# Altium schematic sheet MCUPinout.SchDoc
size 393 x 279 mm; DrawnBy: Gustav Eckerbom; SheetNumber: 5; SheetTotal: 6; Project: alife7-genx320cam; Sheet Name: I/O; Sheet Size: A3; Project Revision: Rev1
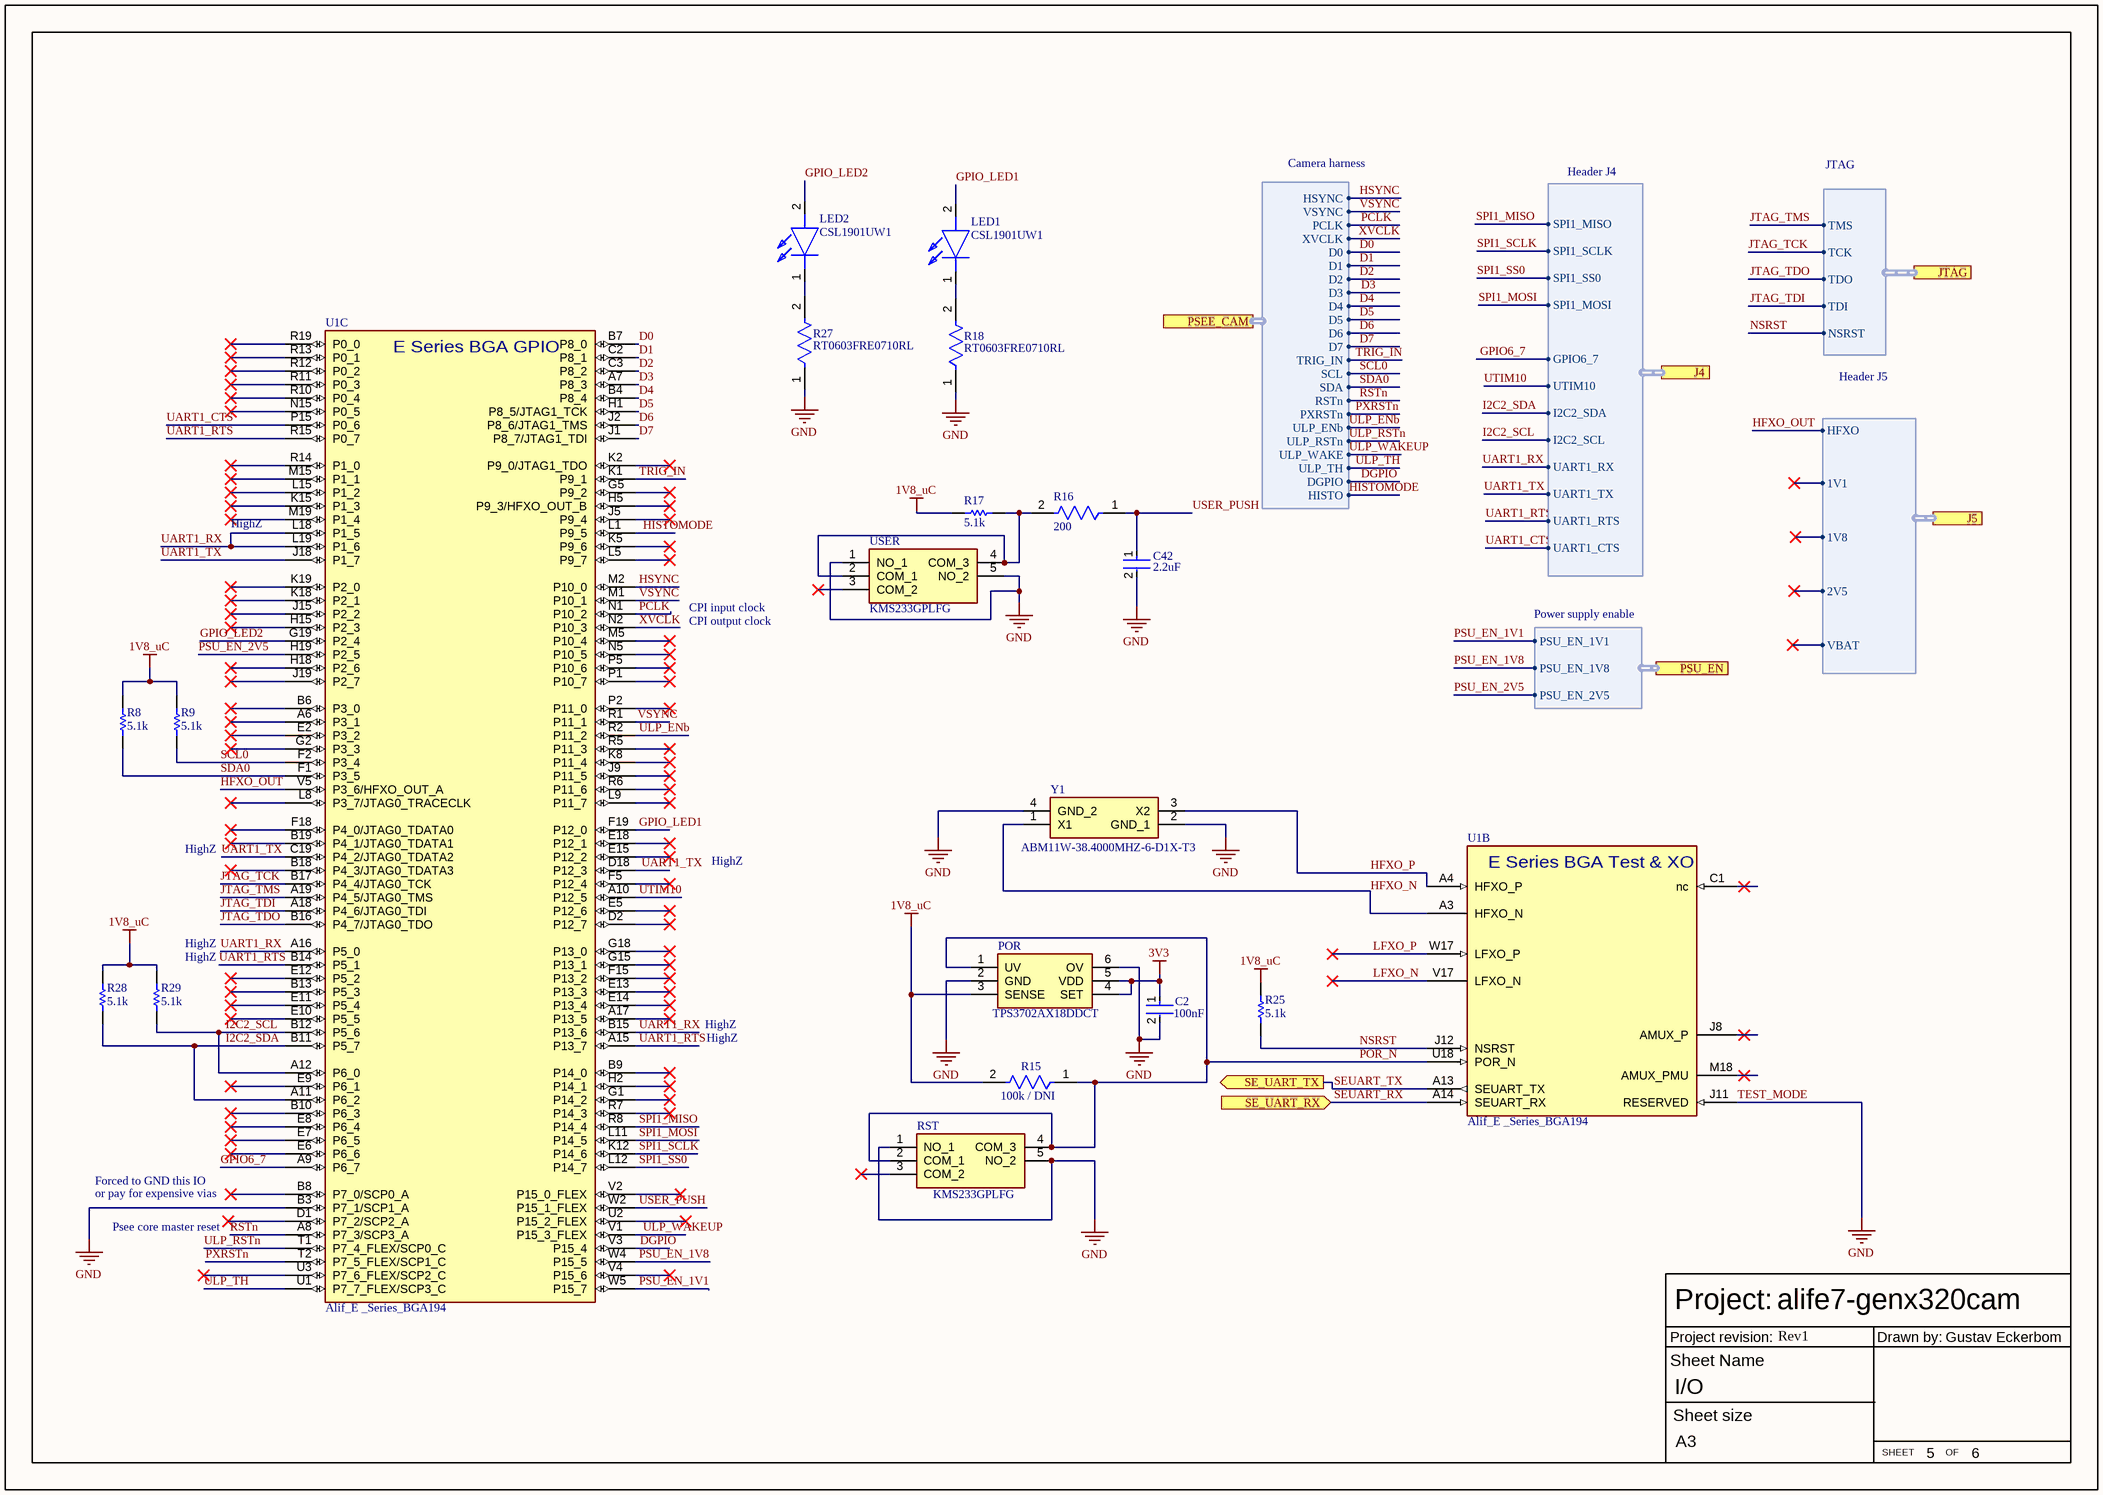
[diagram p0: MCUPinout.SchDoc]

## Parts
C2  100nF  [FP-C0603X104K3RACTU-MFG]
C42  2.2uF  [FP-CC0603-DA-MFG]
LED1  CSL1901UW1  [CSL1901UW1]
LED2  CSL1901UW1  [CSL1901UW1]
POR  TPS3702AX18DDCT  [SOT95P280X110-6N]
R8  5.1k  [RESC1608X55X30LL15T15]
R9  5.1k  [RESC1608X55X30LL15T15]
R15  100k / DNI  [FP-RC0603-0_55-IPC_B]
R16  value 200  [FP-MCR03-IPC_C]  (hidden comment: 200R)
R17  5.1k  [RESC1608X55X30LL15T15]
R18  RT0603FRE0710RL  [FP-RT0603-IPC_C]
R25  5.1k  [RESC1608X55X30LL15T15]
R27  RT0603FRE0710RL  [FP-RT0603-IPC_C]
R28  5.1k  [RESC1608X55X30LL15T15]
R29  5.1k  [RESC1608X55X30LL15T15]
RST  KMS233GPLFG  [KMS233GPLFG]
U1  Alif_E _Series_BGA194  [BGA194 _CENTERED]  (parts B,C of 4)
USER  KMS233GPLFG  [KMS233GPLFG]
Y1  ABM11W-38.4000MHZ-6-D1X-T3  [ABM11W300000MHZ4B1UT3]

## Ports
J4 (harness Header J4), J5 (harness Header J5), JTAG (harness JTAG), PSEE_CAM (harness Camera harness), PSU_EN (harness Power supply enable), SE_UART_RX (in), SE_UART_TX (out)

## Harnesses
JTAG: TMS, TCK, TDO, TDI, NSRST
Power supply enable: PSU_EN_1V1, PSU_EN_1V8, PSU_EN_2V5
Camera harness: HSYNC, VSYNC, PCLK, XVCLK, D0, D1, D2, D3, D4, D5, D6, D7, SCL, SDA, RSTn, PXRSTn, ULP_ENb, ULP_RSTn, ULP_WAKE, ULP_TH, DGPIO, HISTO, TRIG_IN
Header J5: HFXO, 1V1, 2V5, 1V8, VBAT
Header J4: SPI1_MOSI, GPIO6_7, UTIM10, I2C2_SDA, UART1_TX, UART1_RX, I2C2_SCL, SPI1_SS0, SPI1_MISO, SPI1_SCLK, UART1_RTS, UART1_CTS

## Nets
1V8_uC: POR.3(SENSE) R8.2 R9.2 R15.2 R17.2 R25.1 R28.2 R29.2
3V3: C2.1 POR.4(SET) POR.5(VDD)
TEST_MODE: C2.2 C42.2 POR.2(GND) POR.6(OV) R18.1 R27.1 RST.1(NO_1) RST.5(NO_2) U1.B3(P7_1/SCP1_A) U1.J11(RESERVED) USER.1(NO_1) USER.5(NO_2) Y1.2(GND_1) Y1.4(GND_2)  [also labelled GND]
D0: U1.B7(P8_0) ; port PSEE_CAM.D0
D1: U1.C2(P8_1) ; port PSEE_CAM.D1
D2: U1.C3(P8_2) ; port PSEE_CAM.D2
D3: U1.A7(P8_3) ; port PSEE_CAM.D3
D4: U1.B4(P8_4) ; port PSEE_CAM.D4
D5: U1.H1(P8_5/JTAG1_TCK) ; port PSEE_CAM.D5
D6: U1.J2(P8_6/JTAG1_TMS) ; port PSEE_CAM.D6
D7: U1.J1(P8_7/JTAG1_TDI) ; port PSEE_CAM.D7
DGPIO: U1.V3(P15_4) ; port PSEE_CAM.DGPIO
GPIO6_7: U1.A9(P6_7) ; port J4.GPIO6_7
GPIO_LED1: LED1.2(A) U1.F19(P12_0)
GPIO_LED2: LED2.2(A) U1.G19(P2_4)
HFXO_N: U1.A3(HFXO_N) Y1.1(X1)
HFXO_OUT: U1.V5(P3_6/HFXO_OUT_A) ; port J5.HFXO
HFXO_P: U1.A4(HFXO_P) Y1.3(X2)
HISTOMODE: U1.L1(P9_5) ; port PSEE_CAM.HISTO
HSYNC: U1.M2(P10_0) ; port PSEE_CAM.HSYNC
I2C2_SCL: R29.1 U1.A12(P6_0) U1.B12(P5_6) ; port J4.I2C2_SCL
I2C2_SDA: R28.1 U1.A11(P6_2) U1.B11(P5_7) ; port J4.I2C2_SDA
JTAG_TCK: U1.B17(P4_4/JTAG0_TCK) ; port JTAG.TCK
JTAG_TDI: U1.A18(P4_6/JTAG0_TDI) ; port JTAG.TDI
JTAG_TDO: U1.B16(P4_7/JTAG0_TDO) ; port JTAG.TDO
JTAG_TMS: U1.A19(P4_5/JTAG0_TMS) ; port JTAG.TMS
LFXO_N: U1.V17(LFXO_N)
LFXO_P: U1.W17(LFXO_P)
NSRST: R25.2 U1.J12(NSRST) ; port JTAG.NSRST
PCLK: U1.N1(P10_2) ; port PSEE_CAM.PCLK
POR_N: POR.1(UV) R15.1 RST.2(COM_1) RST.4(COM_3) U1.U18(POR_N)
PSU_EN_1V1: U1.W5(P15_7) ; port PSU_EN.PSU_EN_1V1
PSU_EN_1V8: U1.W4(P15_5) ; port PSU_EN.PSU_EN_1V8
PSU_EN_2V5: U1.H19(P2_5) ; port PSU_EN.PSU_EN_2V5
PXRSTn: U1.T2(P7_5_FLEX/SCP1_C) ; port PSEE_CAM.PXRSTn
RSTn: U1.A8(P7_3/SCP3_A) ; port PSEE_CAM.RSTn
SCL0: R9.1 U1.F2(P3_4) ; port PSEE_CAM.SCL
SDA0: R8.1 U1.F1(P3_5) ; port PSEE_CAM.SDA
SEUART_RX: U1.A14(SEUART_RX) ; port SE_UART_RX
SEUART_TX: U1.A13(SEUART_TX) ; port SE_UART_TX
SPI1_MISO: U1.R8(P14_4) ; port J4.SPI1_MISO
SPI1_MOSI: U1.L11(P14_5) ; port J4.SPI1_MOSI
SPI1_SCLK: U1.K12(P14_6) ; port J4.SPI1_SCLK
SPI1_SS0: U1.L12(P14_7) ; port J4.SPI1_SS0
TRIG_IN: U1.K1(P9_1) ; port PSEE_CAM.TRIG_IN
UART1_CTS: U1.P15(P0_6) ; port J4.UART1_CTS
UART1_RTS: U1.A15(P13_7) U1.B14(P5_1) U1.R15(P0_7) ; port J4.UART1_RTS
UART1_RX: U1.A16(P5_0) U1.B15(P13_6) U1.L18(P1_5) U1.L19(P1_6) ; port J4.UART1_RX
UART1_TX: U1.C19(P4_2/JTAG0_TDATA2) U1.D18(P12_3) U1.J18(P1_7) ; port J4.UART1_TX
ULP_ENb: U1.R2(P11_2) ; port PSEE_CAM.ULP_ENb
ULP_RSTn: U1.T1(P7_4_FLEX/SCP0_C) ; port PSEE_CAM.ULP_RSTn
ULP_TH: U1.U1(P7_7_FLEX/SCP3_C) ; port PSEE_CAM.ULP_TH
ULP_WAKEUP: U1.V1(P15_3_FLEX) ; port PSEE_CAM.ULP_WAKE
USER_PUSH: C42.1 R16.1 U1.W2(P15_1_FLEX)
UTIM10: U1.A10(P12_5) ; port J4.UTIM10
VSYNC: U1.M1(P10_1) U1.R1(P11_1) ; port PSEE_CAM.VSYNC
XVCLK: U1.N2(P10_3) ; port PSEE_CAM.XVCLK
NetLED1_1: LED1.1(K) R18.2
NetLED2_1: LED2.1(K) R27.2
NetR16_2: R16.2 R17.1 USER.2(COM_1) USER.4(COM_3)

Not connected (* = marked no-connect by the designer): RST 3(COM_2)*; U1 A6(P3_1)* A17(P13_5)* B6(P3_0)* B8(P7_0/SCP0_A)* B9(P14_0)* B10(P6_3)* B13(P5_3)* B18(P4_3/JTAG0_TDATA3)* B19(P4_1/JTAG0_TDATA1)* C1(nc)* D1(P7_2/SCP2_A)* D2(P12_7)* E2(P3_2)* E5(P12_6)* E6(P6_6)* E7(P6_5)* E8(P6_4)* E9(P6_1)* E10(P5_5)* E11(P5_4)* E12(P5_2)* E13(P13_3)* E14(P13_4)* E15(P12_2)* E18(P12_1)* F5(P12_4)* F15(P13_2)* F18(P4_0/JTAG0_TDATA0)* G1(P14_2)* G2(P3_3)* G5(P9_2)* G15(P13_1)* G18(P13_0)* H2(P14_1)* H5(P9_3/HFXO_OUT_B)* H15(P2_3)* H18(P2_6)* J5(P9_4)* J8(AMUX_P)* J9(P11_5)* J15(P2_2)* J19(P2_7)* K2(P9_0/JTAG1_TDO)* K5(P9_6)* K8(P11_4)* K15(P1_3)* K18(P2_1)* K19(P2_0)* L5(P9_7)* L8(P3_7/JTAG0_TRACECLK)* L9(P11_7)* L15(P1_2)* M5(P10_4)* M15(P1_1)* M18(AMUX_PMU)* M19(P1_4)* N5(P10_5)* N15(P0_5)* P1(P10_7)* P2(P11_0)* P5(P10_6)* R5(P11_3)* R6(P11_6)* R7(P14_3)* R10(P0_4)* R11(P0_3)* R12(P0_2)* R13(P0_1)* R14(P1_0)* R19(P0_0)* U2(P15_2_FLEX)* U3(P7_6_FLEX/SCP2_C)* V2(P15_0_FLEX)* V4(P15_6)*; USER 3(COM_2)*

## Notes on the sheet
- HighZ
- CPI input clock
- CPI output clock
- (near R29) HighZ
- Forced to GND this IO
- or pay for expensive vias
- Psee core master reset
- Project:
- Sheet Name
- Project revision:
- Drawn by:
- Sheet size
- SHEET
- OF
- (in symbol E7_B0_194BGA, part B) E Series BGA Test & XO
- (in symbol E7_B0_194BGA, part C) E Series BGA GPIO

## Library data of the parts
C2 = CMP-2006-00002-2: CAP CER 0.1UF 25V X7R 0603; Dielectric Material: Ceramic; Tolerance: 10%; Dissipation Factor: 3.5%; Features: Soft Termination; Construction: Flat; Number of Pins: 2; Depth: 0.8mm; Case Code (Metric): 1608; Termination: SMD/SMT; REACH SVHC: No SVHC; Dielectric: X7R; Thickness: 0.034inch; Series: C0603X; Case Code (Imperial): 0603; Voltage: 25V; Radiation Hardening: No; Length: 1.6mm; RoHS Compliant: Yes; Case/Package: 0603; Voltage Rating (DC): 25V; Max Operating Temperature: 125°C; Package Quantity: 1; Packaging: Tape and Reel; Width: 0.8mm; Height: 0.8mm; Capacitance: 100nF; Mount: Surface Mount; Voltage Rating: 25V; Contact Plating: Tin; Min Operating Temperature: -55°C
C42 = CMP-03422-000262-1: CAP CER 2.2UF 6.3V X5R 0603; Manufacturer: YAGEO; Manufacturer Part Number: CC0603KRX5R5BB225; Tolerance: 0.1; Temperature Coefficient: 15%; Material: Ceramic; Automotive: No; Temperature: -55°C to +125°C; Device Class L3: Ceramic Capacitors; Voltage Rating: 6.3 V; Device Class L1: Passive Components; Height: 0.9mm; Device Class L2: Capacitors; Temperature Range High: +125°C; Temperature Range Low: -55°C; Footprint Url: http://www.yageo.com/exep/pages/download/literatures/UPY-C_GEN_24.pdf; RoHS: TRUE; Voltage: 6.3 V; Digikey Description: CAP CER 2.2UF 6.3V X5R 0603; Package: CC0603-DA; ComponentLink2Description: Datasheet; Category: Cap; Temperature Characteristic: X5R; Capacitance: 2.2 uF; Value: 2.2 uF; Lead Free: Yes; ComponentLink2URL: http://www.yageo.com/documents/recent/UPY-GPHC_X7R_6.3V-to-50V_18.pdf; Octopart: https://octopart.com/cc0603krx5r5bb225-yageo-42244630; Mouser Description: Multilayer Ceramic Capacitors MLCC - SMD/SMT 2.2uF 6.3V X5R 10%
LED1 LED2 = CSL1901UW1: LED; Manufacturer_Name: ROHM Semiconductor; Datasheet Link: https://www.mouser.kr/datasheet/2/348/csl1901uw1_e-3006038.pdf; Height: 0.65mm; Manufacturer_Part_Number: CSL1901UW1; Mouser Part Number: 755-CSL1901UW1; Mouser Price/Stock: https://www.mouser.co.uk/ProductDetail/ROHM-Semiconductor/CSL1901UW1?qs=vvQtp7zwQdNEDNe2oY5WlQ%3D%3D
POR = TPS3702AX18DDCT: Integrated Circuit; Manufacturer_Name: Texas Instruments; Datasheet Link: http://www.ti.com/lit/gpn/TPS3702; Height: 1.1mm; Manufacturer_Part_Number: TPS3702AX18DDCT; Mouser Part Number: 595-TPS3702AX18DDCT; Mouser Price/Stock: https://www.mouser.co.uk/ProductDetail/Texas-Instruments/TPS3702AX18DDCT?qs=1CfNGUMoiQ%252B2NkXgdoj7UQ%3D%3D; Arrow Part Number: TPS3702AX18DDCT; Arrow Price/Stock: https://www.arrow.com/en/products/tps3702ax18ddct/texas-instruments
R8 R9 R17 R25 R28 R29 = CMP-2000-00803-1: Part Number: ERJ-3GEYJ512V; Manufacturer: Panasonic
R15 = CMP-03412-037829-1: RES 100K OHM 1% 1/10W 0603; Resistance: 100kR; Voltage Rating (DC): 50V; Temperature Coefficient: 100ppm/°C; Power Rating: 100mW; Resistance Tolerance: 1%; Case Code (Metric): 1608; RoHS Compliant: Yes; Case/Package: 0603; Resistor Type: Thick Film; Length: 1.6mm; Depth: 0.8mm; Max Operating Temperature: 155°C; Tolerance: 1%; Series: RC; Contact Plating: Tin; Width: 0.8mm; Case Code (Imperial): 0603; Number of Pins: 2; Construction: Rectangular; Termination: SMD/SMT; Military Standard: Not; Voltage Rating: 50V; Height: 0.45mm; Packaging: Tape and Reel; Min Operating Temperature: -55°C
R16 = CMP-009-00178-1: Fixed Resistor, Metal Glaze/thick Film, 0.1W, 200ohm, 50V, 5% +/-Tol, 200ppm/Cel, Surface Mount, 0603; Power: 100mW; Max Operating Temperature: 155°C; Mounting Technology: Surface Mount; Pins: 2; RoHS Compliant: Yes; Case/Package: 0603; Tolerance: 5%; Min Operating Temperature: -55°C
R18 R27 = CMP-03412-033408-1: RES SMD 10 OHM 1% 1/10W 0603; Manufacturer: Yageo; Voltage Rating: 75V; Power Rating: 0.1W; Temperature Coefficient: 50 ppm/°C; Resistance: 10Ω; Tolerance: 0.01; Value: 10Ω; Footprint Url: http://www.yageo.com/exep/pages/download/literatures/PYu-R_Mount_10.pdf; Ipc Land Pattern Name: RESC16080X45; RoHS: TRUE; Device Class L2: Resistors; Device Class L3: Chip SMD Resistors; Category: Res; Device Class L1: Passive Components; Manufacturer Part Number: RT0603FRE0710RL; ComponentLink2URL: http://www.yageo.com/documents/recent/PYu-RT_1-to-0.01_RoHS_L_9.pdf; Temperature Range Low: -55°C; Height: 0.55mm; Digikey Description: RES SMD 10 OHM 1% 1/10W 0603; Temperature Range High: +155°C; Lead Free: Yes; Composition: Thin Film; Mouser Description: Thin Film Resistors - SMD 1/10W 10 ohm 1% 50ppm; Automotive: No; Package: RT0603; Temperature: -55°C to +155°C; Series: RT; ComponentLink2Description: Datasheet; Octopart: https://octopart.com/rt0603fre0710rl-yageo-39827693
RST USER = KMS233GPLFG: Switch; Manufacturer_Name: C & K COMPONENTS; Datasheet Link: https://www.mouser.com/datasheet/2/240/kms-3050656.pdf; Height: 2mm; Manufacturer_Part_Number: KMS233GPLFG; Mouser Part Number: 611-KMS233GPLFG; Mouser Price/Stock: https://www.mouser.co.uk/ProductDetail/CK/KMS233GPLFG?qs=vOd3edNlRKCgZuExbRx79g%3D%3D; Arrow Part Number: KMS233GPLFG; Arrow Price/Stock: https://www.arrow.com/en/products/kms233gplfg/ck
U1 = E7_B0_194BGA: IC,Alif E7 MCU, Rev B silicon,BGA194; Manufacturer 1: Alif Semi; Manufacturer Part Number 1: AE722F80F55D5LS
Y1 = ABM11W-38.4000MHZ-6-D1X-T3: Crystal or Oscillator; Manufacturer_Name: ABRACON; Datasheet Link: https://abracon.com/Resonators/ABM11W.pdf; Height: 0.5mm; Manufacturer_Part_Number: ABM11W-38.4000MHZ-6-D1X-T3; Mouser Part Number: 815-11W38.4-6D1XT; Mouser Price/Stock: https://www.mouser.co.uk/ProductDetail/ABRACON/ABM11W-38.4000MHZ-6-D1X-T3?qs=5aG0NVq1C4xw6l221qWTrQ%3D%3D